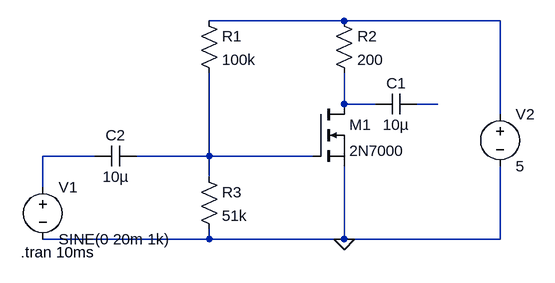
[diagram p0: schematic scheme3.asc]
scheme3.asc, the LTspice schematic file:
Version 4
SHEET 1 880 680
WIRE 288 112 80 112
WIRE 528 112 288 112
WIRE 288 240 288 192
WIRE 336 240 288 240
WIRE 432 240 400 240
WIRE 528 256 528 112
WIRE -96 320 -176 320
WIRE 80 320 80 192
WIRE 80 320 -32 320
WIRE 240 320 80 320
WIRE 80 352 80 320
WIRE -176 368 -176 320
WIRE 80 448 80 432
WIRE 80 448 -176 448
WIRE 288 448 288 336
WIRE 288 448 80 448
WIRE 528 448 528 336
WIRE 528 448 288 448
FLAG 288 448 0
SYMBOL res 64 96 R0
SYMATTR InstName R1
SYMATTR Value 100k
SYMBOL res 272 96 R0
SYMATTR InstName R2
SYMATTR Value 200
SYMBOL nmos 240 240 R0
SYMATTR InstName M1
SYMATTR Value 2N7000
SYMBOL res 64 336 R0
SYMATTR InstName R3
SYMATTR Value 51k
SYMBOL cap -32 304 R90
WINDOW 0 0 32 VBottom 2
WINDOW 3 32 32 VTop 2
SYMATTR InstName C2
SYMATTR Value 10µ
SYMBOL voltage -176 352 R0
WINDOW 123 0 0 Left 2
WINDOW 39 0 0 Left 2
SYMATTR InstName V1
SYMATTR Value SINE(0 20m 1k)
SYMBOL voltage 528 240 R0
WINDOW 123 0 0 Left 2
WINDOW 39 0 0 Left 2
SYMATTR InstName V2
SYMATTR Value 5
SYMBOL cap 400 224 R90
WINDOW 0 0 32 VBottom 2
WINDOW 3 32 32 VTop 2
SYMATTR InstName C1
SYMATTR Value 10µ
TEXT -210 468 Left 2 !.tran 10ms

The netlist it stands for:
* scheme3.asc
R1 N001 N005 100k
R2 N001 N002 200
M1 N002 N005 0 0 2N7000
R3 N005 0 51k
C2 N005 N004 10µ
V1 N004 0 SINE(0 20m 1k)
V2 N001 0 5
C1 N003 N002 10µ
.model NMOS NMOS
.model PMOS PMOS
.lib standard.mos
.tran 10ms
.backanno
.end